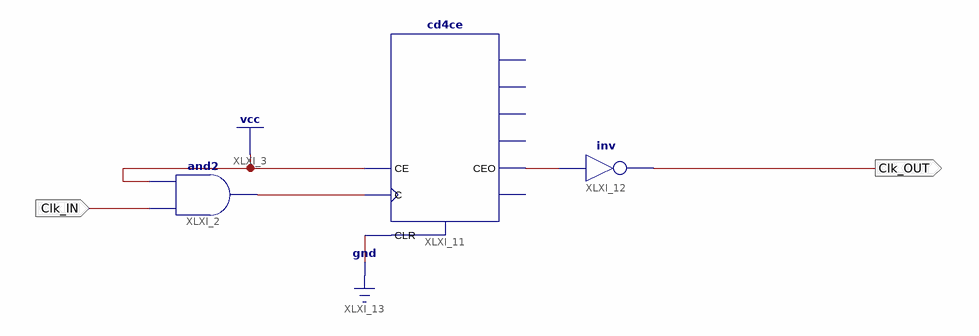
[diagram p0: schematic sheet 1]
// Xilinx ISE schematic div10_3.sch (spartan6) as structural Verilog: 3 symbols, 2 ports
module div10_3 (
  input  Clk_IN,
  output Clk_OUT
);

  wire XLXN_1, XLXN_19;

  and XLXI_2 (XLXN_1, Clk_IN, 1'b1);
  cd4ce XLXI_11 (.C(XLXN_1), .CE(1'b1), .CLR(1'b0), .CEO(XLXN_19));  // open: Q0, Q1, Q2, Q3, TC
  not XLXI_12 (Clk_OUT, XLXN_19);
endmodule
